# Altium schematic sheet CAN_controller_trancs.SchDoc
size A; SheetNumber: 6; SheetTotal: 7
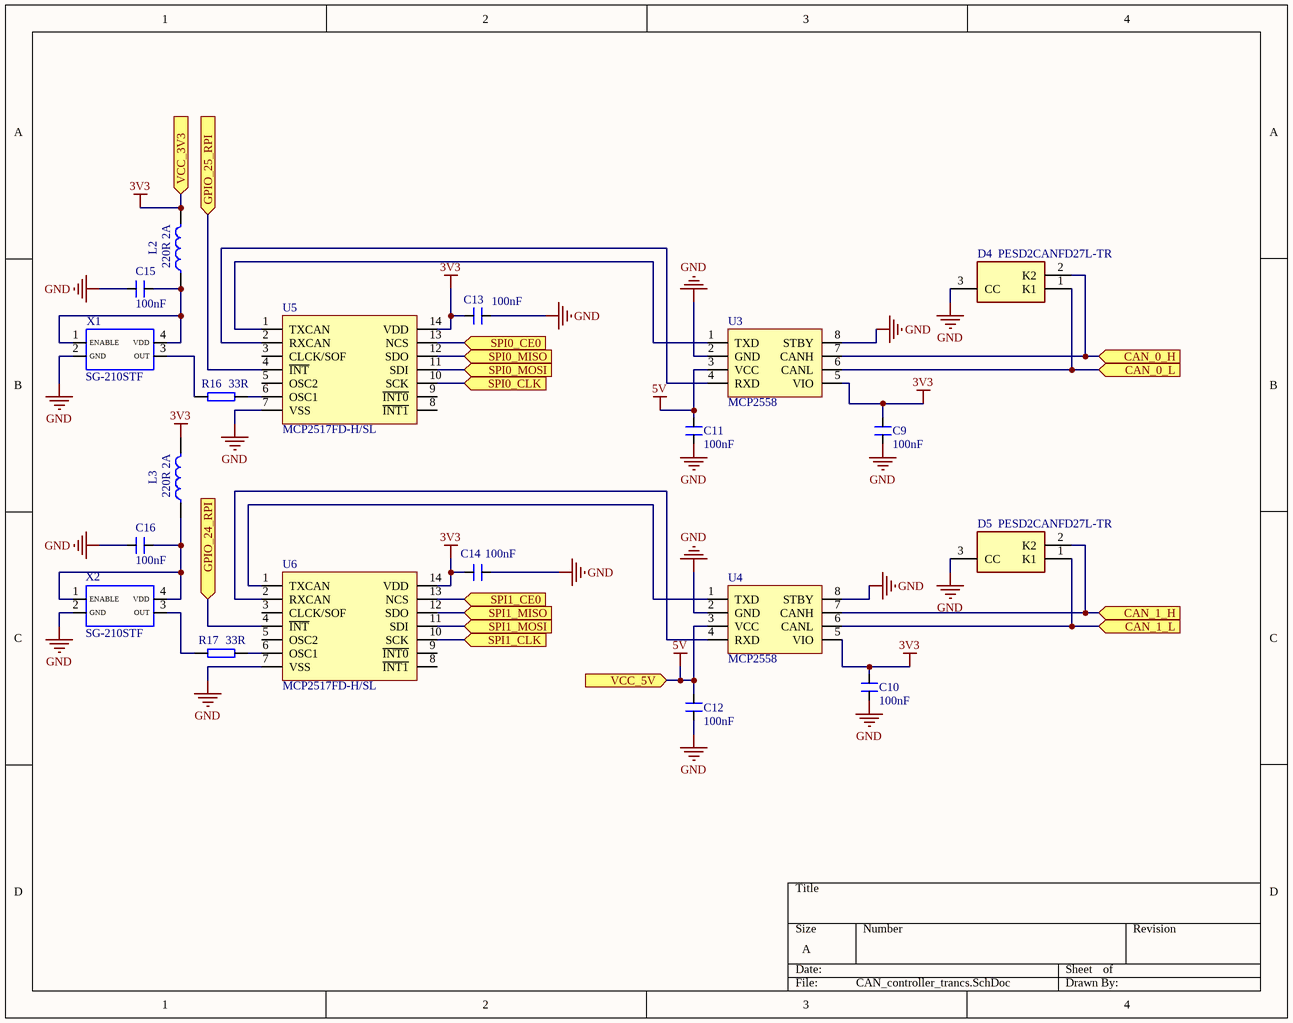
[diagram p0: CAN_controller_trancs.SchDoc]

## Parts
C9  100nF  [CAP_0805]
C10  100nF  [CAP_0805]
C11  100nF  [CAP_0805]
C12  100nF  [CAP_0805]
C13  100nF  [CAP_0805]
C14  100nF  [CAP_0805]
C15  100nF  [CAP_0805]
C16  100nF  [CAP_0805]
D4  PESD2CANFD27L-TR  [SOT95P230X110-3N]
D5  PESD2CANFD27L-TR  [SOT95P230X110-3N]
L2  220R 2A  [L_0805]
L3  220R 2A  [L_0805]
R16  33R  [RES0402]
R17  33R  [RES0402]
U3  MCP2558  [MCP2557_SOIC8]
U4  MCP2558  [MCP2557_SOIC8]
U5  MCP2517FD-H/SL  [MCP2517FD_SOIC14]
U6  MCP2517FD-H/SL  [MCP2517FD_SOIC14]
X1  SG-210STF  [Osc]
X2  SG-210STF  [Osc]

## Ports
CAN_0_H (in, see schematic[3C], switch_conn[2B]), CAN_0_L (in, see schematic[3C], switch_conn[2B]), CAN_1_H (in, see schematic[3C], switch_conn[2B]), CAN_1_L (in, see schematic[3C], switch_conn[2B]), GPIO_24_RPI (in, see schematic[3C]), GPIO_25_RPI (in, see schematic[3C]), SPI0_CE0 (in, see schematic[3B], Connectors pinout[1B]), SPI0_CLK (in, see schematic[3B], Connectors pinout[2B]), SPI0_MISO (in, see schematic[3B], Connectors pinout[2B]), SPI0_MOSI (in, see schematic[3B], Connectors pinout[2B]), SPI1_CE0 (in, see schematic[3B], Connectors pinout[1B]), SPI1_CLK (in, see schematic[3B], Connectors pinout[1B]), SPI1_MISO (in, see schematic[3B], Connectors pinout[2B]), SPI1_MOSI (in, see schematic[3B], Connectors pinout[1B]), VCC_3V3 (in, see schematic[3C]), VCC_5V (in, see schematic[3C], Buck_Converter[3B])

## Nets
3V3: C9.2 C10.2 C13.1 C14.1 L2.2 L3.2 U3.5(VIO) U4.5(VIO) U5.14(VDD) U6.14(VDD) ; port VCC_3V3
5V: C11.2 C12.2 U3.3(VCC) U4.3(VCC) ; port VCC_5V
GND: C9.1 C10.1 C11.1 C12.1 C13.2 C14.2 C15.2 C16.2 D4.3(CC) D5.3(CC) U3.2(GND) U3.8(STBY) U4.2(GND) U4.8(STBY) U5.7(VSS) U6.7(VSS) X1.2(GND) X2.2(GND)
CAN_0_H: D4.2(K2) U3.7(CANH) ; port CAN_0_H
CAN_0_L: D4.1(K1) U3.6(CANL) ; port CAN_0_L
CAN_1_H: D5.2(K2) U4.7(CANH) ; port CAN_1_H
CAN_1_L: D5.1(K1) U4.6(CANL) ; port CAN_1_L
GPIO_24_RPI: U6.4(~{INT}) ; port GPIO_24_RPI
GPIO_25_RPI: U5.4(~{INT}) ; port GPIO_25_RPI
SPI0_CE0: U5.13(NCS) ; port SPI0_CE0
SPI0_CLK: U5.10(SCK) ; port SPI0_CLK
SPI0_MISO: U5.12(SDO) ; port SPI0_MISO
SPI0_MOSI: U5.11(SDI) ; port SPI0_MOSI
SPI1_CE0: U6.13(NCS) ; port SPI1_CE0
SPI1_CLK: U6.10(SCK) ; port SPI1_CLK
SPI1_MISO: U6.12(SDO) ; port SPI1_MISO
SPI1_MOSI: U6.11(SDI) ; port SPI1_MOSI
NetC15_1: C15.1 L2.1 X1.1(ENABLE) X1.4(VDD)
NetC16_1: C16.1 L3.1 X2.1(ENABLE) X2.4(VDD)
NetR16_1: R16.1 X1.3(OUT)
NetR16_2: R16.2 U5.6(OSC1)
NetR17_1: R17.1 X2.3(OUT)
NetR17_2: R17.2 U6.6(OSC1)
NetU3_1: U3.1(TXD) U5.1(TXCAN)
NetU3_4: U3.4(RXD) U5.2(RXCAN)
NetU4_1: U4.1(TXD) U6.1(TXCAN)
NetU4_4: U4.4(RXD) U6.2(RXCAN)

Not connected (* = marked no-connect by the designer): U5 3(CLCK/SOF) 5(OSC2) 8(~{INT1}) 9(~{INT0}); U6 3(CLCK/SOF) 5(OSC2) 8(~{INT1}) 9(~{INT0})

## Library data of the parts
C9-C16 = CAP_0805
D4 D5 = PESD2CANFD27L-TR: Diode; Manufacturer_Name: Nexperia; Datasheet Link: https://assets.nexperia.com/documents/data-sheet/PESD2CANFD27L-T.pdf; Height: 1.1mm; Manufacturer_Part_Number: PESD2CANFD27L-TR; Mouser Part Number: 771-PESD2CANFD27L-TR; Mouser Price/Stock: https://www.mouser.co.uk/ProductDetail/Nexperia/PESD2CANFD27L-TR?qs=hWgE7mdIu5THSw1DtVHdDg%3D%3D
L2 L3 = Inductor
R16 R17 = RES 0402